# EasyEDA Pro project ProDoc_cyrus_V2.epro, board PCB2
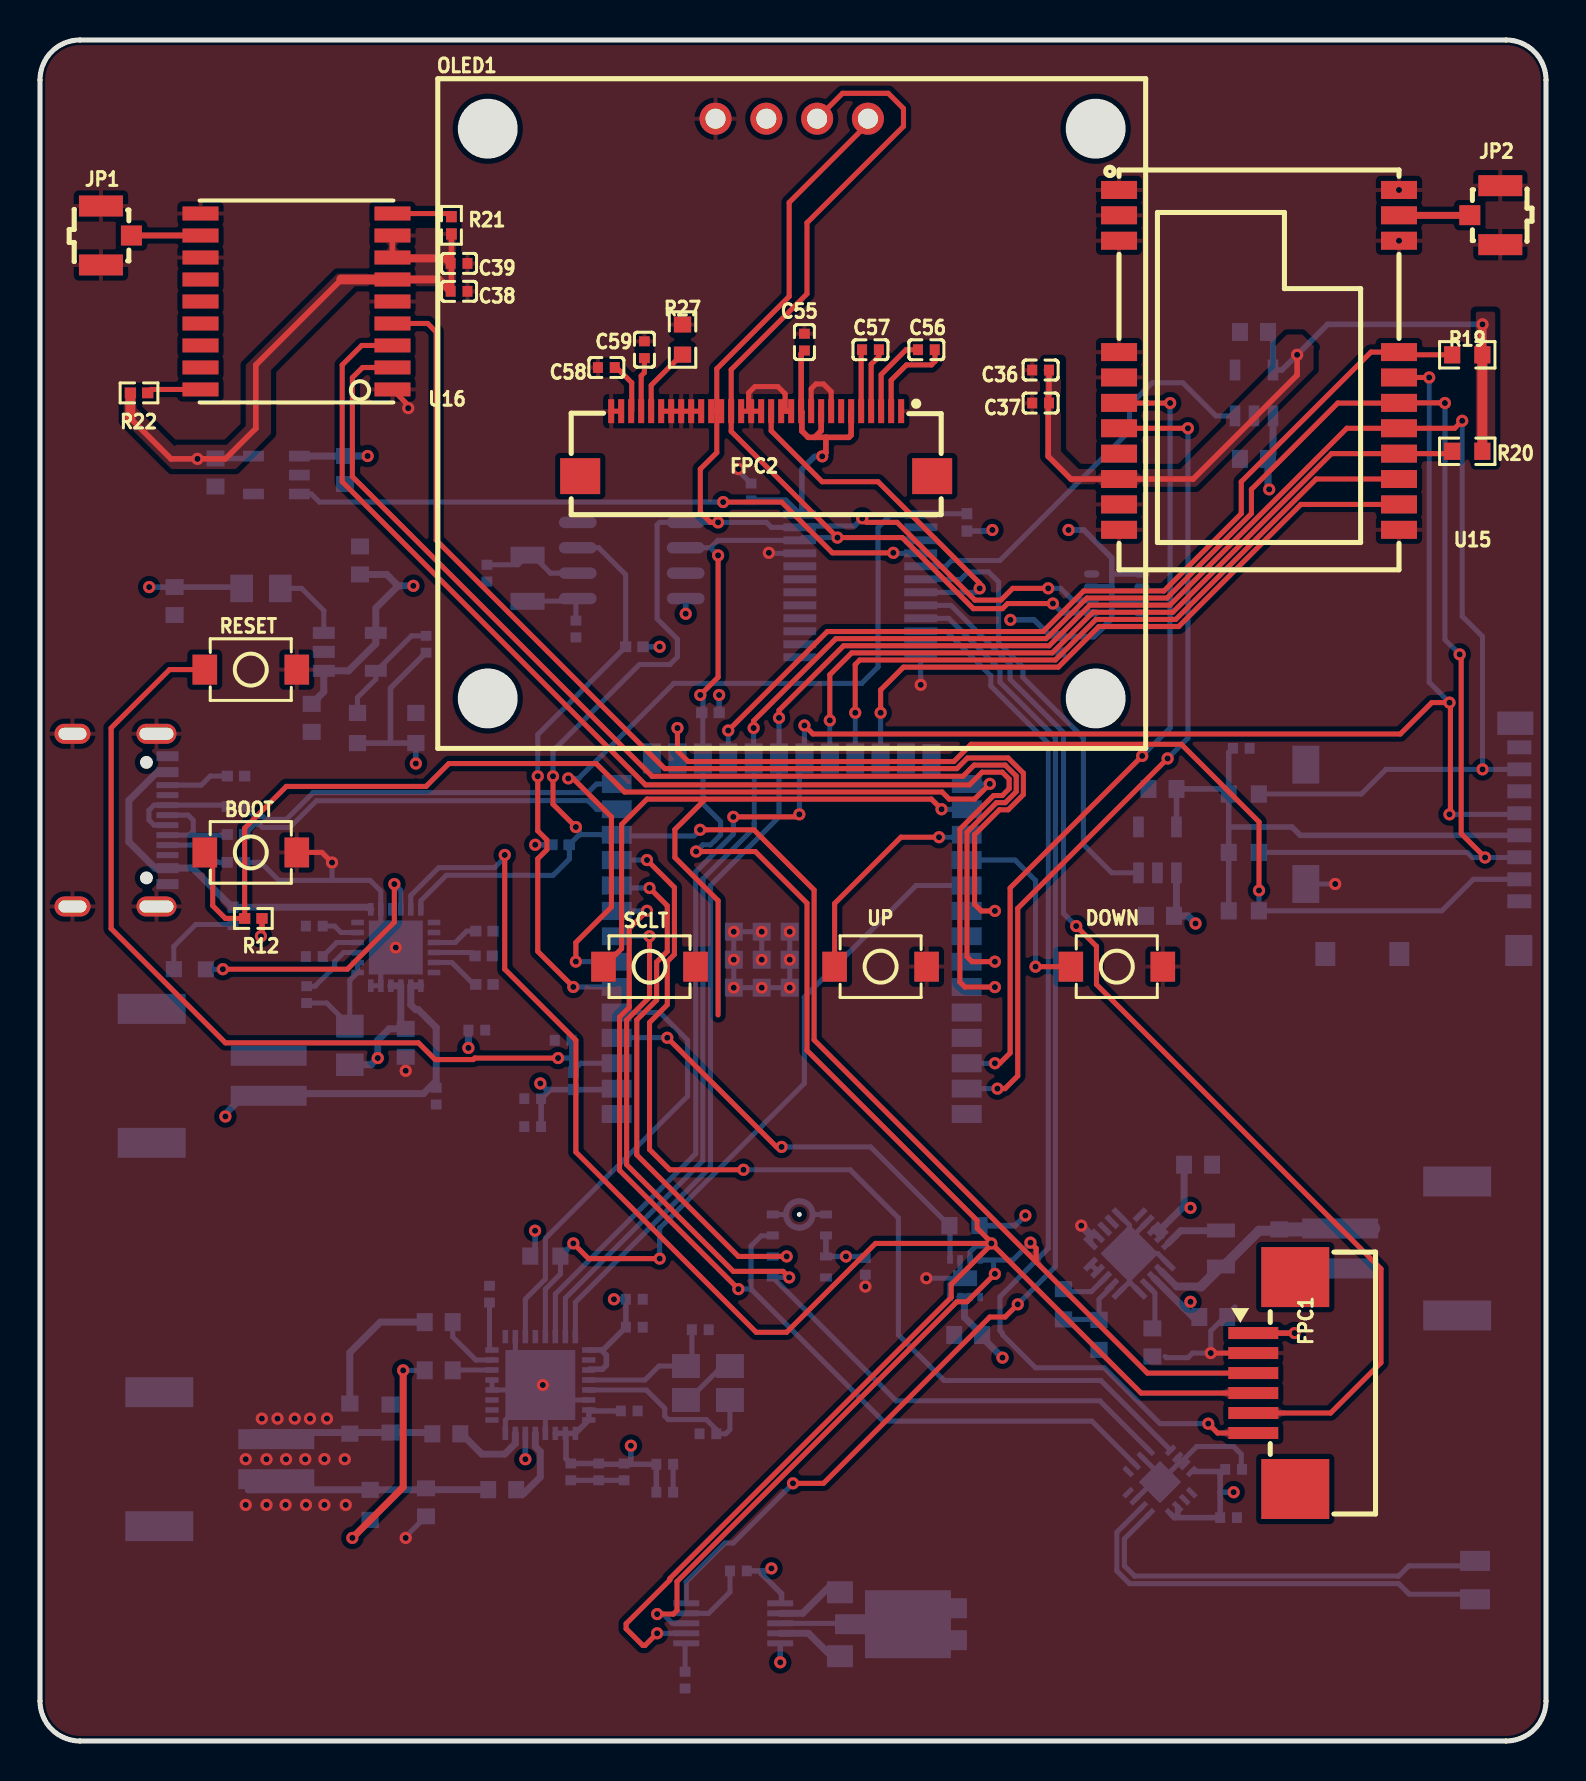
[diagram p5: board, top side]
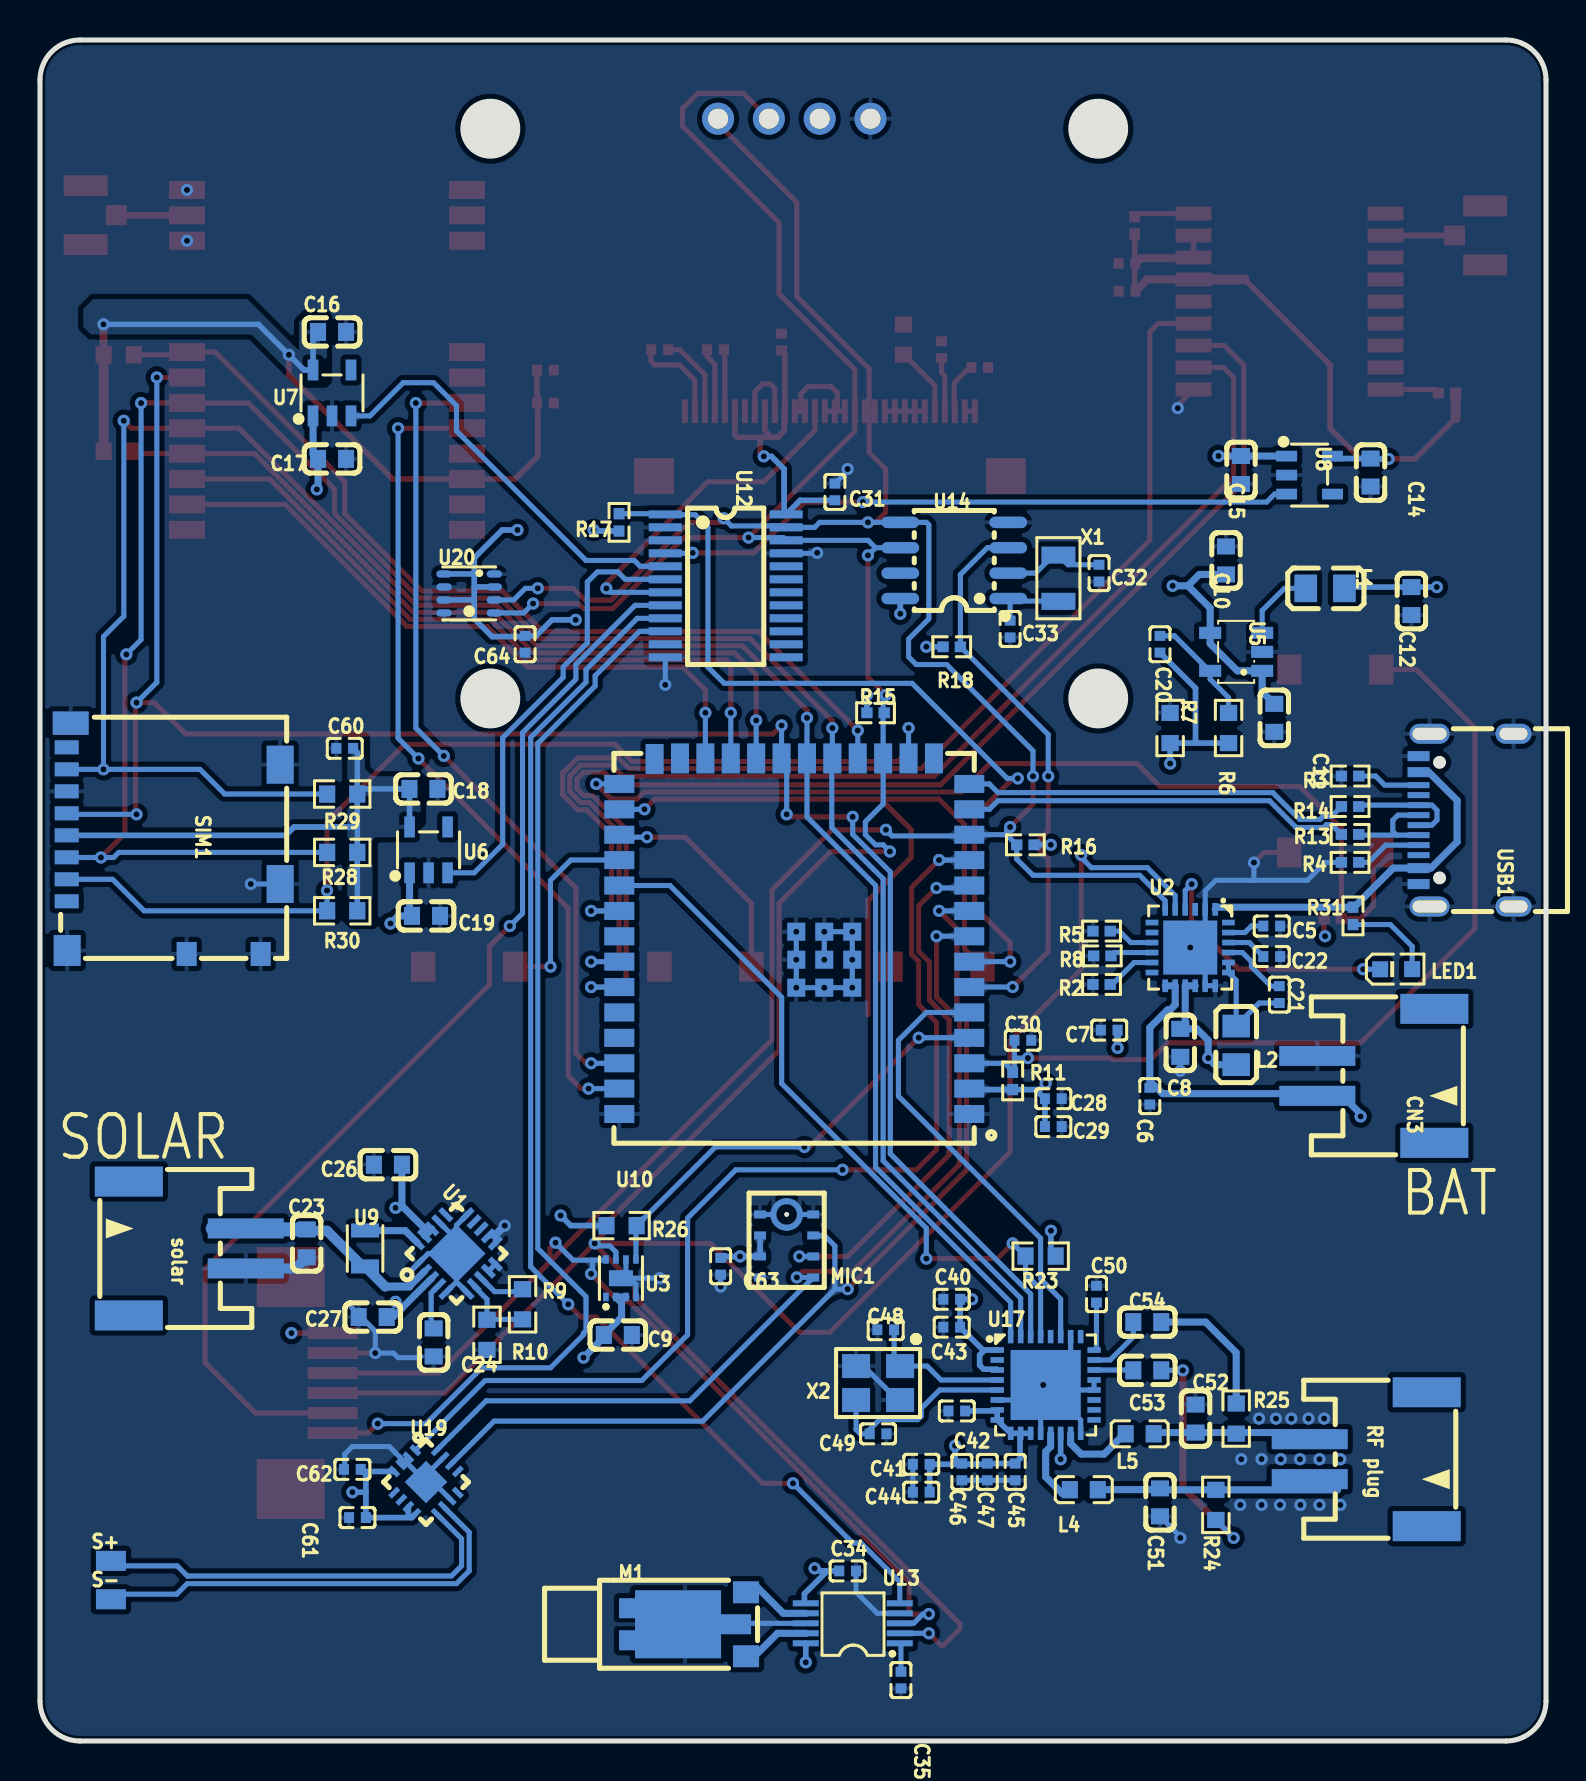
[diagram p6: board, bottom side, seen from below]

Outline 75.31 x 85.09 mm; copper layers: Top Layer, GND, VDD3V3, Inner3, Inner4, Inner5, Inner6, Inner7, Inner8, Inner9, Inner10, Inner11, Inner12, Inner13, Inner14, Inner15, Inner16, Inner17, Inner18, Inner19, Inner20, Inner21, Inner22, Inner23, Inner24, Inner25, Inner26, Inner27, Inner28, Inner29, Inner30, Bottom Layer. Coordinates in mm from the lower left corner of the outline.
Outline path: 0,83.09 0,2 arc(0.59,0.59) 2,0 73.31,0 arc(74.73,0.59) 75.31,2 75.31,83.09 arc(74.73,84.5) 73.31,85.09 2,85.09 arc(0.59,84.5) 0,83.09
Stack: Top Layer 0.035mm Outer layer thickness 1oz / Dielectric1 0.2104mm 7628 RC49% 8.6mil / GND 0.0152mm Inner layer thickness / Dielectric2 1.065mm 1.1mm H/HOZ Copper / VDD3V3 0.0152mm Inner layer thickness / Dielectric3 0.2104mm 7628 RC49% 8.6mil / Bottom Layer 0.035mm Outer layer thickness 1oz

## Design rules (mm)
net USB_DN: DP1
net USB_DP: DP1
template: Custom Config
spacing copperThickness1oz (default): track to track 0.102, other pairs 0.152 to 0.3
spacing copperThickness2oz: track to track 0.203, other pairs 0.152 to 0.3
track width copperThickness1oz (default): min 0.127, default 0.254, max 2.54
track width copperThickness2oz: min 0.203, default 0.254, max 2.54
track width vbus: min 0.127, default 0.35, max 2.54
track width VDD3V3: min 0.127, default 0.28, max 2.54
differential pair differentialPair (default): width min 0.127, default 0.254, max 2.54; gap min 0.152, default 0.152
via viaSize (default): diameter min 0.5, default 0.61, max 10; hole min 0.3, default 0.305, max 6.3
net VBAT uses vbus
net VSYS uses vbus
net VDD3V3 uses VDD3V3
net GPS_VDD uses VDD3V3
net LORA_VDD uses VDD3V3
net SD_VDD uses VDD3V3
net VBUS uses vbus

## Placement (name value [footprint] x y rotation side)
BOOT  TS-1088-AR02016  [SW-SMD_L3.9-W2.9-LS4.8]  10.54 44.45 0 top
C5  10uF  [C0402]  13.72 40.77 180 bottom
C6  10uF  [C0402]  19.81 32.26 270 bottom
C7  10uF  [C0402]  21.84 35.56 180 bottom
C8  22uF  [C0603]  18.29 34.93 270 bottom
C9  100nF  [C0603]  46.42 20.31 0 bottom
C10  10uF  [C0603]  16 59.06 270 bottom
C11  100nF  [C0603]  13.59 51.18 90 bottom
C12  22uF  [C0603]  6.73 57.02 90 bottom
C14  10uF  [C0603]  8.78 63.45 270 bottom
C15  100nF  [C0603]  15.25 63.58 270 bottom
C16  10uF  [C0603]  60.71 70.49 180 bottom
C17  100nF  [C0603]  60.71 64.14 180 bottom
C18  10uF  [C0603]  56.13 47.63 180 bottom
C19  100nF  [C0603]  56.01 41.28 180 bottom
C20  22pF  [C0402]  19.3 54.86 90 bottom
C21  47nF  [C0402]  13.34 37.34 90 bottom
C22  10uF  [C0402]  13.72 39.24 180 bottom
C23  4.7uF  [C0603]  61.98 24.89 90 bottom
C24  10nF  [C0603]  55.63 19.94 90 bottom
C26  4.7uF  [C0603]  57.91 28.83 0 bottom
C27  100nF  [C0603]  58.67 21.21 0 bottom
C28  100nF  [C0402]  24.64 32.13 180 bottom
C29  10uF  [C0402]  24.64 30.73 180 bottom
C30  1uF  [C0402]  26.16 35.05 0 bottom
C31  100nF  [C0402]  35.56 62.48 90 bottom
C32  12pF  [C0402]  22.35 58.42 90 bottom
C33  12pF  [C0402]  26.8 55.63 90 bottom
C34  100nF  [C0402]  34.92 8.51 180 bottom
C35  1uF  [C0402]  32.26 3.05 90 bottom
C36  10uF  [C0402]  50.04 68.58 180 top
C37  100nF  [C0402]  50.04 66.93 180 top
C38  10uF  [C0402]  20.95 72.52 180 top
C39  100nF  [C0402]  20.95 73.91 0 top
C40  100nF  [C0402]  29.72 22.1 180 bottom
C41  100nF  [C0402]  31.24 13.84 180 bottom
C42  100nF  [C0402]  29.46 16.51 180 bottom
C43  100nF  [C0402]  29.72 20.7 180 bottom
C44  100nF  [C0402]  31.24 12.45 180 bottom
C45  100nF  [C0402]  26.54 13.46 90 bottom
C46  100nF  [C0402]  29.21 13.46 90 bottom
C47  100nF  [C0402]  27.94 13.46 90 bottom
C48  10pF  [C0402]  33.02 20.57 0 bottom
C49  10pF  [C0402]  33.4 15.37 0 bottom
C50  1uF  [C0402]  22.48 22.35 90 bottom
C51  100pF  [C0603]  19.3 11.94 270 bottom
C52  100pF  [C0603]  17.53 16.13 90 bottom
C53  1nF  [C0603]  19.94 18.54 0 bottom
C54  1nF  [C0603]  19.94 20.96 0 bottom
C55  100nF  [C0402]  38.23 69.98 270 top
C56  1uF  [C0402]  44.32 69.6 0 top
C57  1uF  [C0402]  41.53 69.6 0 top
C58  4.7uF  [C0402]  28.32 68.71 0 top
C59  4.7uF  [C0402]  30.23 69.6 270 top
C60  100nF  [C0402]  60.07 49.66 180 bottom
C61  10uF  [C0402]  59.44 11.18 180 bottom
C62  100nF  [C0402]  59.69 13.59 180 bottom
C63  100nF  [C0402]  41.27 23.75 270 bottom
C64  100nF  [C0402]  51.05 54.86 270 bottom
CN3  S2B-PH-SM4-TB(LF)(SN)  [CONN-SMD_P2.00_S2B-PH-SM4-TB-LF-SN]  8.51 33.27 90 bottom
DOWN  TS-1088-AR02016  [SW-SMD_L3.9-W2.9-LS4.8]  53.85 38.74 0 top
FPC1  FPC1.0-WSS11-6P211-H25  [FPC-SMD_FPC1.0-WSS11-6P211-H25]  61.72 17.91 90 top
FPC2  FPC-05FB-30PH20  [FPC-SMD_30P-P0.50_FPC-05FB-30PH20]  35.81 64.9 0 top
JP1  6GHz  [RF-SMD_FRF05002-JSS103M]  3.81 75.31 90 top
JP2  6GHz  [RF-SMD_FRF05002-JSS103M]  72.26 76.33 270 top
L1  2.2uH  [L0805]  11.05 57.66 0 bottom
L2  1uH  [L0805]  15.49 34.8 270 bottom
L4  470nH  [L0603]  23.11 12.57 180 bottom
L5  470nH  [L0603]  20.32 15.37 180 bottom
LED1  -  [LED0603-RD_GREEN]  7.49 38.61 180 bottom
M1  Z3OC1T8219731  [VIBRATING-MOTOR-SMD_3P-C9900001680]  41.53 5.84 180 bottom
MIC1  INMP441  [MIC-SMD_INMP441]  37.97 24.77 0 bottom
OLED1  HS13L03W2C01  [OLED-TH_L35.4-W33.5_HS13L03W2C01]  37.59 81.15 0 top
R2  NTCG104BH103HT1  [R0402]  22.23 37.85 0 bottom
R3  5.1kΩ  [R0402]  9.8 48.27 0 bottom
R4  5.1kΩ  [R0402]  9.8 43.95 0 bottom
R5  10kΩ  [R0402]  22.23 40.51 180 bottom
R6  100kΩ  [R0603]  15.88 50.67 270 bottom
R7  22.1kΩ  [R0603]  18.8 50.67 90 bottom
R8  200Ω  [R0402]  22.19 39.28 0 bottom
R9  10MΩ  [R0603]  51.18 21.84 90 bottom
R10  7.5MΩ  [R0603]  52.96 20.32 90 bottom
R11  10kΩ  [R0402]  26.67 33.02 270 bottom
R12  10kΩ  [R0402]  10.67 41.15 180 top
R13  22Ω  [R0402]  9.8 45.35 0 bottom
R14  22Ω  [R0402]  9.8 46.75 0 bottom
R15  4.7kΩ  [R0402]  33.53 51.44 0 bottom
R16  4.7kΩ  [R0402]  26.04 44.83 180 bottom
R17  10kΩ  [R0402]  46.36 60.96 90 bottom
R18  10kΩ  [R0402]  29.72 54.74 180 bottom
R19  10kΩ  [R0603]  71.37 69.34 180 top
R20  10kΩ  [R0603]  71.37 64.52 0 top
R21  10kΩ  [R0402]  20.57 75.82 90 top
R22  10kΩ  [R0402]  4.95 67.44 180 top
R23  10kΩ  [R0603]  25.27 24.26 180 bottom
R24  10kΩ  [R0603]  16.51 11.81 270 bottom
R25  10kΩ  [R0603]  15.49 16.13 90 bottom
R26  10kΩ  [R0603]  46.23 25.78 180 bottom
R27  560kΩ  [R0603]  32.13 70.1 270 top
R28  10kΩ  [R0603]  60.2 44.45 180 bottom
R29  10kΩ  [R0603]  60.2 47.37 180 bottom
R30  10kΩ  [R0603]  60.2 41.53 180 bottom
R31  1kΩ  [R0402]  9.65 41.28 270 bottom
RESET  TS-1088-AR02016  [SW-SMD_L3.9-W2.9-LS4.8]  10.54 53.59 180 top
RF plug  S2B-PH-SM4-TB(LF)(SN)  [CONN-SMD_P2.00_S2B-PH-SM4-TB-LF-SN]  8.89 14.1 90 bottom
S+  -  [Test-Point-0.5mm]  71.76 9.01 0 bottom
S-  -  [Test-Point-0.5mm]  71.76 7.09 0 bottom
SCLT  TS-1088-AR02016  [SW-SMD_L3.9-W2.9-LS4.8]  30.48 38.74 0 top
SIM1  1040310811  [SIM-SMD_8P-1040310811]  68.64 45.14 270 bottom
solar  S2B-PH-SM4-TB(LF)(SN)  [CONN-SMD_P2.00_S2B-PH-SM4-TB-LF-SN]  67.95 24.64 270 bottom
U1  BQ25570RGRR  [VQFN-20_L3.5-W3.5-P0.50-BL-EP2.0]  54.48 24.38 225 bottom
U2  BQ25896RTWR  [QFN-24_L4.0-W4.0-P0.50-TL-EP2.7]  17.79 39.69 270 bottom
U3  MAX17048G+T10  [TDFN-8_L2.0-W2.0-P0.50-BL-EP1.2]  46.26 23.15 180 bottom
U5  SY8089AAAC  [SOT-23-5_L3.0-W1.7-P0.95-LS2.8-BR]  15.49 54.48 180 bottom
U6  RT9080-33GJ5  [TSOT-23-5_L2.9-W1.6-P0.95-LS2.8-BL]  55.88 44.58 180 bottom
U7  RT9080-33GJ5  [TSOT-23-5_L2.9-W1.6-P0.95-LS2.8-BL]  60.71 67.43 180 bottom
U8  RT9080-33GJ5  [TSOT-23-5_L2.9-W1.6-P0.95-LS2.8-BL]  11.82 63.33 270 bottom
U9  22uH  [IND-SMD_L1.8-W1.3]  59.05 24.64 90 bottom
U10  2.4GHz  [WIRELM-SMD_ESP32-S3-WROOM-1U]  37.59 40.26 0 bottom
U12  XL9555  [TSSOP-24_L7.8-W4.4-P0.65-LS6.4-BL]  41.02 57.79 270 bottom
U13  -  [DRV2605LDGSR]  34.8 5.72 90 bottom
U14  PCF85063AT/A  [SO-8_L4.9-W3.9-P1.27-LS5.9-BL]  29.59 59.06 90 bottom
U15  E22-900M22S  [WIRELM-SMD_E22-900M22S]  60.96 69.09 180 top
U16  MAX-M10S-00B  [SMD-18_L10.1-W9.7-P1.10-TL_SKG09F]  12.83 72.01 180 top
U17  ST25R3916-AQWT  [VFQFPN-32_L5.0-W5.0-P0.50-TL-EP3.5]  25.02 17.81 180 bottom
U19  MAX98357AETE+T  [TQFN-16_L3.0-W3.0-P0.50-BL-EP1.5]  56.01 12.95 315 bottom
U20  BME280  [LGA-8_BME280_BL]  53.85 57.4 180 bottom
UP  TS-1088-AR02016  [SW-SMD_L3.9-W2.9-LS4.8]  42.04 38.74 0 top
USB1  HX TYPE-C-3.1-16PIN  [TYPE-C-SMD_HX-TYPE-C-16PIN]  4 46.07 90 bottom
X1  32.768kHz  [OSC-SMD_L3.2-W1.5]  24.38 58.17 270 bottom
X2  27.12MHz  [CRYSTAL-SMD_4P-L3.2-W2.5-BL_SIT8008BI]  33.4 17.91 0 bottom

## Footprints (pads in the part's own frame, mm; a bottom-side part is the same pattern mirrored in y, then rotated)
C0402
  rect 0.5x0.54 smd: 1(-0.42,0) 2(0.42,0)
C0603
  rect 0.8x0.9 smd: 1(-0.7,0) 2(0.7,0)
CONN-SMD_P2.00_S2B-PH-SM4-TB-LF-SN
  rect 1x3.8 smd: 1(-1,2.925) 2(1,2.925)
  rect 1.5x3.4 smd: 3(3.35,-2.925) 4(-3.35,-2.925)
CRYSTAL-SMD_4P-L3.2-W2.5-BL_SIT8008BI
  rect 1.4x1.2 smd: 1(-1.1,-0.85) 2(1.1,-0.85) 3(1.1,0.85) 4(-1.1,0.85)
DRV2605LDGSR
  rect 0.3x1.3 smd: 1(-0.827,-2.481) 2(-0.327,-2.481) 3(0.173,-2.481) 4(0.673,-2.481) 5(1.173,-2.481) 6(1.173,2.219) 7(0.673,2.219) 8(0.173,2.219) 9(-0.327,2.219) 10(-0.827,2.219)
FPC-SMD_30P-P0.50_FPC-05FB-30PH20
  rect 0.3x1.2 smd: 1(7.25,1.625) 2(6.75,1.625) 3(6.25,1.625) 4(5.75,1.625) 5(5.25,1.625) 6(4.75,1.625) 7(4.25,1.625) 8(3.75,1.625) 9(3.25,1.625) 10(2.75,1.625) 11(2.25,1.625) 12(1.75,1.625) 13(1.25,1.625) 14(0.75,1.625) 15(0.25,1.625) 16(-0.25,1.625) 17(-0.75,1.625) 18(-1.25,1.625) 19(-1.75,1.625) 20(-2.25,1.625) 21(-2.75,1.625) 22(-3.25,1.625) 23(-3.75,1.625) 24(-4.25,1.625) 25(-4.75,1.625) 26(-5.25,1.625) 27(-5.75,1.625) 28(-6.25,1.625) 29(-6.75,1.625) 30(-7.25,1.625)
  rect 2x1.8 smd: 31(-8.8,-1.625) 32(8.8,-1.625)
FPC-SMD_FPC1.0-WSS11-6P211-H25
  rect 0.6x2.5 smd: 1(2.5,1.05) 2(1.5,1.05) 3(0.5,1.05) 4(-0.5,1.05) 5(-1.5,1.05) 6(-2.5,1.05)
  rect 3x3.4 smd: 7(-5.3,-1.05) 8(5.3,-1.05)
IND-SMD_L1.8-W1.3
  rect 0.7x1.4 smd: 1(-0.9,0) 2(0.9,0)
L0603
  rect 0.8x0.864 smd: 1(-0.7,0) 2(0.7,0)
L0805
  rect 1.133x1.377 smd: 1(-0.966,0) 2(0.966,0)
LED0603-RD_GREEN
  rect 0.8x0.8 smd: 1(-0.799,-0.004) 2(0.799,0.004)
LGA-8_BME280_BL
  oval 0.767x0.364 smd: 1(1.258,0.975) 2(1.258,0.325) 3(1.258,-0.325) 4(1.258,-0.975) 5(-1.258,-0.975) 6(-1.258,-0.325) 7(-1.258,0.325) 8(-1.258,0.975)
MIC-SMD_INMP441
  rect 0.6x0.4 smd: 1(-1.33,1.575) 2(-1.33,0.525) 3(-1.33,-0.525) 4(-1.33,-1.575) 6(1.33,-1.575) 7(1.33,-0.525) 8(1.33,0.525) 9(1.33,1.575)
  custom 0.966x1.626 smd: 5(-0.661,-1.575)
  custom 0.963x1.626 smd: 5(0.664,-1.575)
OLED-TH_L35.4-W33.5_HS13L03W2C01
  round 1.6 hole 1: 1(-3.81,0) 2(-1.27,0) 3(1.27,0) 4(3.81,0)
OSC-SMD_L3.2-W1.5
  rect 0.85x1.7 smd: 1(-1.155,0) 2(1.155,0)
QFN-24_L4.0-W4.0-P0.50-TL-EP2.7
  rect 0.633x0.28 smd: 1(-1.911,1.25) 2(-1.911,0.75) 3(-1.911,0.25) 4(-1.911,-0.25) 5(-1.911,-0.75) 6(-1.911,-1.25) 13(1.911,-1.25) 14(1.911,-0.75) 15(1.911,-0.25) 16(1.911,0.25) 17(1.911,0.75) 18(1.911,1.25)
  rect 0.28x0.633 smd: 7(-1.25,-1.911) 8(-0.75,-1.911) 9(-0.25,-1.911) 10(0.25,-1.911) 11(0.75,-1.911) 12(1.25,-1.911) 19(1.25,1.911) 20(0.75,1.911) 21(0.25,1.911) 22(-0.25,1.911) 23(-0.75,1.911) 24(-1.25,1.911)
  rect 2.7x2.7 smd: 25(0,0)
R0402
  rect 0.566x0.54 smd: 1(-0.433,0) 2(0.433,0)
R0603
  rect 0.806x0.864 smd: 1(-0.753,0) 2(0.753,0)
RF-SMD_FRF05002-JSS103M
  rect 1x1.05 smd: 1(0,-0.762)
  rect 1.05x2.2 smd: 2(-1.475,0.762) 3(1.475,0.762)
SIM-SMD_8P-1040310811
  rect 0.7x1.2 smd: 1(3.138,-5.338) 2(2.038,-5.338) 3(0.938,-5.338) 4(-0.163,-5.338) 5(-1.262,-5.338) 6(-2.362,-5.338) 7(-3.462,-5.338) 8(-4.562,-5.338)
  rect 1.17x1.8 smd: 9(-5.772,-5.138)
  rect 1.55x1.35 smd: 10(5.598,-5.312)
  rect 1.2x1 smd: 11(5.772,0.662) 12(5.772,4.362)
  rect 1.9x1.35 smd: 13(2.272,5.338) 14(-3.697,5.338)
SMD-18_L10.1-W9.7-P1.10-TL_SKG09F
  rect 1.8x0.7 smd: 1(-4.8,4.4) 2(-4.8,3.3) 3(-4.8,2.2) 4(-4.8,1.1) 5(-4.8,0) 6(-4.8,-1.1) 7(-4.8,-2.2) 8(-4.8,-3.3) 9(-4.8,-4.4) 10(4.8,-4.4) 11(4.8,-3.3) 12(4.8,-2.2) 13(4.8,-1.1) 14(4.8,0) 15(4.8,1.1) 16(4.8,2.2) 17(4.8,3.3) 18(4.8,4.4)
SO-8_L4.9-W3.9-P1.27-LS5.9-BL
  oval 0.574x1.888 smd: 1(-1.905,-2.699) 2(-0.635,-2.699) 3(0.635,-2.699) 4(1.905,-2.699) 5(1.905,2.699) 6(0.635,2.699) 7(-0.635,2.699) 8(-1.905,2.699)
SOT-23-5_L3.0-W1.7-P0.95-LS2.8-BR
  rect 1.1x0.6 smd: 1(1.3,-0.95) 2(1.3,0) 3(1.3,0.95) 4(-1.3,0.95) 5(-1.3,-0.95)
SW-SMD_L3.9-W2.9-LS4.8
  rect 1.23x1.5 smd: 1(-2.3,0) 2(2.3,0)
TDFN-8_L2.0-W2.0-P0.50-BL-EP1.2
  rect 0.28x0.425 smd: 1(-0.75,-0.938) 2(-0.25,-0.938) 3(0.25,-0.938) 4(0.75,-0.938) 5(0.75,0.938) 6(0.25,0.938) 7(-0.25,0.938) 8(-0.75,0.938)
  rect 1.2x0.8 smd: 9(0,0)
Test-Point-0.5mm
  rect 1.5x1 smd: 1(0,0)
TQFN-16_L3.0-W3.0-P0.50-BL-EP1.5
  rect 0.25x0.6 smd: 1(-0.749,-1.5) 2(-0.248,-1.5) 3(0.252,-1.5) 4(0.751,-1.5) 9(0.75,1.5) 10(0.25,1.5) 11(-0.25,1.5) 12(-0.749,1.5)
  rect 0.6x0.25 smd: 5(1.5,-0.748) 6(1.5,-0.248) 7(1.5,0.252) 8(1.5,0.752) 13(-1.5,0.752) 14(-1.5,0.252) 15(-1.5,-0.248) 16(-1.5,-0.748)
  rect 1.5x1.5 smd: 17(0,0)
TSOT-23-5_L2.9-W1.6-P0.95-LS2.8-BL
  rect 0.532x1.045 smd: 1(-0.95,-1.147) 2(0,-1.147) 3(0.95,-1.147) 4(0.95,1.147) 5(-0.95,1.147)
TSSOP-24_L7.8-W4.4-P0.65-LS6.4-BL
  rect 0.4x1.65 smd: 1(-3.575,-3.022) 2(-2.925,-3.022) 3(-2.275,-3.022) 4(-1.625,-3.022) 5(-0.975,-3.022) 6(-0.325,-3.022) 7(0.325,-3.022) 8(0.975,-3.022) 9(1.625,-3.022) 10(2.275,-3.022) 11(2.925,-3.022) 12(3.575,-3.022) 13(3.575,3.022) 14(2.925,3.022) 15(2.275,3.022) 16(1.625,3.022) 17(0.975,3.022) 18(0.325,3.022) 19(-0.325,3.022) 20(-0.975,3.022) 21(-1.625,3.022) 22(-2.275,3.022) 23(-2.925,3.022) 24(-3.575,3.022)
TYPE-C-SMD_HX-TYPE-C-16PIN
  oval 1x2 hole 0.6x1.7: 17(-4.32,1.825) 20(4.32,1.825)
  oval 1x1.8 hole 0.6x1.4: 18(-4.32,-2.376) 19(4.32,-2.376)
  rect 0.3x1.1 smd: A5(-1.25,2.374) A6(-0.25,2.374) A7(0.25,2.374) A8(1.25,2.376) B5(1.75,2.374) B6(0.75,2.374) B7(-0.75,2.374) B8(-1.75,2.376)
  rect 0.5x1.1 smd: A9B4(2.4,2.375) A12B1(3.2,2.375) B9A4(-2.4,2.375) B12A1(-3.2,2.375)
VFQFPN-32_L5.0-W5.0-P0.50-TL-EP3.5
  rect 0.665x0.28 smd: 1(-2.42,1.75) 2(-2.42,1.25) 3(-2.42,0.75) 4(-2.42,0.25) 5(-2.42,-0.25) 6(-2.42,-0.75) 7(-2.42,-1.25) 8(-2.42,-1.75) 17(2.42,-1.75) 18(2.42,-1.25) 19(2.42,-0.75) 20(2.42,-0.25) 21(2.42,0.249) 22(2.42,0.75) 23(2.42,1.25) 24(2.42,1.75)
  rect 0.28x0.665 smd: 9(-1.75,-2.42) 10(-1.25,-2.42) 11(-0.75,-2.42) 12(-0.249,-2.42) 13(0.251,-2.42) 14(0.75,-2.42) 15(1.25,-2.42) 16(1.75,-2.42) 25(1.75,2.42) 26(1.25,2.42) 27(0.75,2.42) 28(0.251,2.42) 29(-0.249,2.42) 30(-0.75,2.42) 31(-1.25,2.42) 32(-1.75,2.42)
  rect 3.5x3.5 smd: 33(0,0)
VIBRATING-MOTOR-SMD_3P-C9900001680
  rect 1.3x1.1 smd: 1(1.525,1.6) 2(1.525,-1.6)
  custom 6.6x3.4 smd: 3(-1.525,0)
VQFN-20_L3.5-W3.5-P0.50-BL-EP2.0
  rect 0.28x0.8 smd: 1(-1.001,-1.751) 2(-0.501,-1.751) 3(-0.001,-1.751) 4(0.499,-1.751) 5(1,-1.749) 11(0.999,1.749) 12(0.501,1.751) 13(-0.001,1.749) 14(-0.501,1.749) 15(-1.001,1.749)
  rect 0.8x0.28 smd: 6(1.75,-0.999) 7(1.75,-0.499) 8(1.75,0.001) 9(1.75,0.501) 10(1.75,1.001) 16(-1.75,0.999) 17(-1.75,0.499) 18(-1.75,-0.001) 19(-1.75,-0.501) 20(-1.75,-1.001)
  rect 2.05x2.05 smd: 21(-0.001,-0.001)
WIRELM-SMD_E22-900M22S
  rect 1.8x0.9 smd: 1(7,-8.5) 2(7,-7.23) 3(7,-5.96) 4(7,-0.39) 5(7,0.88) 6(7,2.15) 7(7,3.42) 8(7,4.69) 9(7,5.96) 10(7,7.23) 11(7,8.5) 12(-7,8.5) 13(-7,7.23) 14(-7,5.96) 15(-7,4.69) 16(-7,3.42) 17(-7,2.15) 18(-7,0.88) 19(-7,-0.39) 20(-7,-5.96) 21(-7,-7.23) 22(-7,-8.5)
WIRELM-SMD_ESP32-S3-WROOM-1U
  rect 1.5x0.9 smd: 1(-8.75,8.895) 2(-8.75,7.625) 3(-8.75,6.355) 4(-8.75,5.085) 5(-8.75,3.815) 6(-8.75,2.545) 7(-8.75,1.275) 8(-8.75,0.005) 9(-8.75,-1.265) 10(-8.75,-2.535) 11(-8.75,-3.805) 12(-8.75,-5.075) 13(-8.75,-6.345) 14(-8.75,-7.615) 27(8.75,-7.615) 28(8.75,-6.345) 29(8.75,-5.075) 30(8.75,-3.805) 31(8.75,-2.535) 32(8.75,-1.265) 33(8.75,0.005) 34(8.75,1.275) 35(8.75,2.545) 36(8.75,3.815) 37(8.75,5.085) 38(8.75,6.355) 39(8.75,7.625) 40(8.75,8.895)
  rect 0.9x1.5 smd: 15(-6.985,-8.895) 16(-5.715,-8.895) 17(-4.445,-8.895) 18(-3.175,-8.895) 19(-1.905,-8.895) 20(-0.635,-8.895) 21(0.635,-8.895) 22(1.905,-8.895) 23(3.175,-8.895) 24(4.445,-8.895) 25(5.715,-8.895) 26(6.985,-8.865)
  rect 0.9x0.9 smd: 41(-2.9,-0.225) 41(-2.9,1.175) 41(-2.9,2.575) 41(-1.5,-0.225) 41(-1.5,1.175) 41(-1.5,2.575) 41(-0.1,-0.225) 41(-0.1,1.175) 41(-0.1,2.575)

## Nets
As in the schematic, except:
GND: BOOT.2 C5.2 C6.2 C7.1 C8.2 C9.1 C10.1 C11.1 C12.1 C14.2 C15.2 C16.2 C17.2 C18.2 C19.2 C22.2 C23.1 C24.1 C26.2 C27.2 C28.2 C29.2 C30.1 C31.2 C32.1 C33.1 C34.2 C35.1 C36.2 C37.2 C38.1 C39.2 C40.1 C41.1 C42.1 C43.1 C44.1 C45.1 C46.1 C47.1 C48.2 C49.1 C50.2 C51.2 C52.2 C55.1 C58.1 C59.1 C60.1 C61.1 C62.1 C63.2 C64.2 CN3.2 DOWN.2 FPC1.2 FPC2.1 FPC2.8 FPC2.10 FPC2.12 FPC2.13 FPC2.15 FPC2.16 FPC2.17 FPC2.21 FPC2.22 FPC2.23 FPC2.24 FPC2.25 FPC2.29 FPC2.30 JP1.2 JP1.3 JP2.2 JP2.3 M1.3 MIC1.4 MIC1.5 MIC1.6 MIC1.9 OLED1.1 R2.2 R3.2 R4.2 R5.1 R7.2 R8.2 R10.1 R27.1 RESET.1 SCLT.2 SIM1.6 SIM1.9 SIM1.10 SIM1.11 SIM1.12 SIM1.13 SIM1.14 solar.2 U1.1 U1.5 U1.6 U1.9 U1.10 U1.11 U1.12 U1.15 U1.17 U1.21 U2.2 U2.17 U2.18 U2.25 U3.4 U3.6 U3.9 U5.2 U6.2 U7.2 U8.2 U10.1 U10.40 U10.41 U12.2 U12.3 U12.12 U12.21 U13.4 U13.8 U14.4 U15.1 U15.2 U15.3 U15.4 U15.5 U15.10 U15.11 U15.12 U15.20 U15.22 U16.1 U16.5 U16.10 U16.12 U17.6 U17.12 U17.16 U17.20 U17.21 U17.26 U17.33 U19.2 U19.3 U19.11 U19.15 U19.17 U20.1 U20.5 U20.7 UP.2 USB1.17 USB1.18 USB1.19 USB1.20 USB1.A12B1 USB1.B12A1 X2.2 X2.4
$1N5582: C23.2 solar.1 U1.2 U9.1
$4N2173: JP1.1 U16.11
$4N4448: C51.1 L4.2 R24.1 RF plug.1
$4N4453: C52.1 L5.2 R25.1 RF plug.2

Pads without a net: CN3 3 4; FPC1 7 8; FPC2 7 31 32; RF plug 3 4; SIM1 1 8; solar 3 4; U1 13 14 16; U2 3 7 8 12 24; U3 1; U6 4; U7 4; U8 4; U10 15 25 26 33 36 37; U12 11 13 14 15 16 17 18 19 20; U14 7; U15 8; U16 13 15 16 17; U17 2 17 18 19 25 28; U19 5 6 12 13; USB1 A8 B8

## Via types
v1: diameter 0.61, hole 0.305, Top Layer to Bottom Layer, 154 vias

## Routing (per net, layer and track width the routed paths; a pad name or vN(x,y) marks a point on that pad's centre or on a via; arc(x,y) is an arc through that point)
GND: length 132.8
  Top Layer w0.254: FPC2.16 35.44,66.65 35.44,67.44 35.75,67.75 36.9,67.75 37.26,67.38 37.26,66.62 37.36,66.52 ; FPC2.16 FPC2.17 ; FPC2.16 FPC2.15 ; v1(18.42,66.68) 18.42,66.82 U16.1 ; v1(14.61,43.94) 14.1,44.45 BOOT.2 ; 37.36,66.52 FPC2.13 ; 37.36,66.52 FPC2.12 ; FPC2.29 FPC2.30 ; FPC2.8 39.56,67.5 39.18,67.88 38.8,67.88 38.56,67.65 FPC2.10 ; FPC2.25 FPC2.24 FPC2.23 FPC2.22 FPC2.21 ; 60.67,19.41 v1(58.55,19.41)
  GND w0.254: v1(15.29,11.81) v1(14.22,11.81) v1(13.3,11.81) v1(12.28,11.81) v1(11.33,11.81) v1(10.29,11.81) v1(10.29,14.1) ; v1(10.29,14.1) 10.29,15.32 v1(11.09,16.13) v1(11.88,16.13) v1(12.74,16.13) v1(13.5,16.13) v1(14.35,16.13) ; v1(10.29,14.1) v1(11.33,14.1) v1(12.31,14.1) v1(13.27,14.1) v1(15.24,14.1)
  Bottom Layer w0.254: U19.17 56.01,13.3 U19.15 ; U19.17 57.04,13.98 57.1,13.98 ; U19.17 55.65,12.95 U19.11 ; U3.4 45.51,22.86 45.8,23.15 ; 14.59,43.05 11.94,43.05 11.04,43.95 R4.2 ; 14.59,43.05 14.61,43.07 v1(14.61,43.94) ; 14.59,43.05 16.51,43.05 17.04,42.52 U2.2 17.04,40.44 v1(17.79,39.69) 17.04,38.94 U2.17 U2.18 ; v1(36.09,39.08) v1(36.09,40.48) v1(34.69,40.48) v1(34.69,39.08) v1(34.69,37.68) v1(36.09,37.68) v1(37.49,37.68) v1(37.49,39.08) v1(37.49,40.48) ; 55.37,25.98 54.48,25.09 54.48,25.8 53.95,26.33 ; U17.26 23.77,19.06 U17.33 25.27,17.56 ; C51.2 18.29,10.22 v1(18.29,10.16) ; 56.89,14.19 57.1,13.98 ; 57.1,13.98 U19.3 ; 57.1,13.98 57.85,14.73 59.69,14.73 60.07,14.35 60.07,13.63 C62.1 ; C46.1 C47.1 C45.1 ; U12.12 v1(44.04,52.83) ; 54.48,22.97 54.48,22.97 U1.5 ; 54.48,22.97 U1.6 ; 54.48,22.97 U1.21 55.9,24.38 U1.1 ; U3.6 46.01,23.4 U3.9 45.8,23.15 ; C34.2 34.51,7.45 33.44,6.39 U13.4 ; v1(34.92,63.63) 34.92,63.54 C31.2 ; 45.8,23.15 v1(44.32,23.15) ; U17.6 25.77,17.06 25.27,17.56 ; U1.10 U1.9 ; 52.54,24.91 52.54,25.31 ; U17.16 23.27,16.06 24.77,17.56 U17.20 U17.21 ; 38.64,26.34 39.3,26.34 ; 25.27,17.56 U17.12 ; C63.2 v1(41.27,22.73) ; C41.1 C44.1 ; 56.26,19.24 56.32,19.18 57.4,19.18 57.63,19.41 v1(58.55,19.41) 58.55,20.51 59.76,21.72 ; v1(36.45,59.44) 36.48,59.41 U12.21 ; U13.8 42.75,5.89 43.05,5.59 ; C8.2 v1(18.29,33.53) ; X2.2 34.12,18.76 32.42,17.06 X2.4 ; 63.3,42.87 v1(64.77,42.87) ; U1.12 52.58,25.27 ; 37.31,26.34 36.64,26.34
  Bottom Layer w0.4: 52.54,25.31 v1(52.07,25.78)
  Bottom Layer w0.5: 66.67,23.64 62.53,23.64 C23.1
  vias: v1(14.22,14.1) v1(25.14,17.81) v1(67.96,77.59) v1(67.96,75.05)
VBAT: length 118
  VDD3V3 w0.35: v1(57.53,26.67) v1(57.53,21.97) 54.74,19.18 v1(48.13,19.18) 49.02,18.29 49.02,10.16 40.64,1.78 31.11,1.78 21.34,11.56 21.34,25.15 17.78,28.7 11.81,28.7 v1(9.27,31.24)
  Bottom Layer w0.35: v1(57.53,26.67) 57.31,26.67 57.21,26.77 ; 57.21,26.77 55.89,25.45 ; 57.21,26.77 C26.1 ; v1(57.53,21.97) 57.23,21.67 57.2,21.67 ; 55.89,25.45 U1.18 ; 55.89,25.45 U1.19 ; C27.1 57.66,21.21 57.2,21.67 ; U2.13 18.54,37.78 18.54,36.83 18.79,36.58 18.92,36.58 19.81,35.69 19.81,33.02 19.18,32.39 10.29,32.39 9.27,31.37 v1(9.27,31.24) ; U1.3 57.2,21.67 ; U3.3 U3.2 46.23,21.93 46.23,21.2 C9.2 47.12,20.19 v1(48.13,19.18)
VBUS: length 18.1
  Bottom Layer w0.35: USB1.A9B4 5.86,48.47 4.45,47.05 4.45,44.97 5.75,43.67 USB1.B9A4 7.64,43.67 9.6,41.71 R31.1 16.44,41.71 U2.1
VDD3V3: length 335.6
  Top Layer w0.28: FPC2.6 40.56,65.33 40.45,65.21 39.3,65.21 ; C55.2 38.06,69.39 FPC2.11 38.1,66.49 38.1,65.53 38.42,65.21 38.73,65.21 ; FPC2.9 39.06,65.54 38.73,65.21 ; 39.3,65.21 38.73,65.21 ; 39.3,65.21 39.3,64.45 v1(39.12,64.26) ; R12.1 11.1,40.31 v1(11.05,40.26) ; 60.67,20.41 v1(62.74,20.41)
  VDD3V3 w0.28: OLED1.2 39.12,78.36 v1(39.12,64.26) 46.23,64.26 47.63,62.87 v1(47.63,60.58) v1(51.44,60.58) ; 33.04,53.62 33.96,52.7 v1(33.96,52.32) ; 33.04,53.62 24.77,45.34 v1(24.77,44.83) 24.77,33.15 v1(25.02,32.89) 25.02,32 24.77,31.75 ; 33.04,53.62 31.45,55.2 ; 33.04,53.62 35.51,56.08 v1(48.53,56.08) ; 31.45,55.2 32.29,56.04 v1(32.29,56.39) ; 31.45,55.2 v1(30.99,54.74) ; v1(5.46,57.72) 10.35,57.72 13.97,54.1 13.97,50.17 15.24,48.9 15.72,48.9 ; 49.28,25.53 49.28,26.29 ; 49.28,25.53 41.53,25.53 40.26,24.26 39.5,24.26 37.08,21.84 29.97,21.84 29.72,22.1 ; 49.28,25.53 50.17,25.53 54.74,30.1 60.45,30.1 62.74,27.81 v1(62.74,20.41) 62.74,13.46 61.72,12.45 v1(59.69,12.45) ; 24.27,25.49 v1(24.27,14.1) 27.69,14.1 28.36,14.77 ; 24.27,25.49 24.3,25.53 v1(24.76,25.53) ; 24.27,25.49 24.27,31.26 24.77,31.75 ; 15.72,48.9 11.05,44.22 v1(11.05,40.26) 11.05,34.93 14.22,31.75 24.77,31.75 ; 15.72,48.9 v1(18.8,48.9) ; v1(37.02,3.94) 37.02,8.2 v1(36.58,8.64) 32,8.64 29.55,11.09 v1(29.55,14.77) 28.36,14.77 ; 29.72,22.1 v1(28.7,22.1) ; 29.72,22.1 29.59,21.97 29.59,20.7 28.5,19.61 28.5,14.91 28.36,14.77
  Bottom Layer w0.28: C31.1 37.29,62.06 U12.24 38.1,61.46 38.1,63.63 38.73,64.26 v1(39.12,64.26) ; 25.51,32.59 R11.2 28.8,32.59 U10.2 ; 25.51,32.59 25.33,32.59 v1(25.02,32.89) ; 25.51,32.59 C28.1 C29.1 ; 29.55,13.84 27.98,13.84 C47.2 C45.2 26.3,14.12 26.3,15.36 U17.10 ; 29.55,13.84 C41.2 C44.2 ; 29.55,13.84 v1(29.55,14.77) ; 17.55,49.92 17.53,49.94 17.53,52.67 C20.1 ; 17.55,49.92 R7.1 v1(18.8,48.9) ; 17.55,49.92 R6.2 ; U17.1 28.07,19.56 ; 28.07,19.56 28.32,19.3 28.32,18.8 28.12,18.6 27.48,18.6 U17.3 ; 28.07,19.56 28.16,19.56 C43.2 C40.2 v1(28.7,22.1) ; MIC1.7 MIC1.8 v1(40.3,24.24) 41.2,24.24 C63.1 ; 24.76,24.38 v1(24.76,25.53) ; v1(5.46,57.72) C12.2 10.02,57.72 L1.1 ; v1(33.96,52.32) R15.2 ; C34.1 36.07,8.51 ; 36.07,8.51 36.07,8.38 37.08,7.37 37.08,6.96 U13.6 ; 36.07,8.51 36.45,8.51 v1(36.58,8.64) ; U19.7 56.89,11.34 56.72,11.18 ; U20.8 53.61,58.38 53.59,58.37 ; R26.1 48.77,25.78 v1(49.28,26.29) ; 59.02,12.43 C61.2 56.72,11.18 ; 59.02,12.43 59.03,12.45 v1(59.69,12.45) ; 59.02,12.43 59.02,13.34 59.16,13.48 ; v1(47.63,60.58) 47.57,60.53 R17.1 ; U14.8 v1(32.29,56.39) ; 56.72,11.18 56.54,11.36 ; 53.59,57.06 53.62,57.08 U20.6 ; 53.59,57.06 53.59,57.73 ; 53.59,57.06 53.59,56.13 52.7,55.25 51.09,55.25 C64.1 50.51,55.28 49.71,56.08 v1(48.53,56.08) ; 59.16,13.48 59.27,13.59 ; 59.16,13.48 U19.4 ; C42.2 27.49,16.51 U17.7 U17.8 26.77,15.39 U17.10 ; R18.1 v1(30.99,54.74) ; 53.59,57.73 53.59,58.37 ; 53.59,57.73 U20.2 ; R16.2 v1(24.77,44.83) ; U17.11 U17.10 ; 53.59,58.37 53.59,59.18 52.2,60.58 v1(51.44,60.58) ; U13.10 v1(37.02,3.94) ; U17.14 v1(24.27,14.1)
ANT: length 3.5
  Top Layer w0.254: JP2.1 71.49,76.32
  Top Layer w0.349: 71.49,76.32 U15.21
BAT_ALRT: length 22
  Top Layer w0.254: v1(31.37,35.18) 36.83,29.72 v1(37.08,29.72)
  Bottom Layer w0.254: v1(31.37,35.18) 28.85,35.18 U10.4 ; v1(37.08,29.72) 41.54,29.72 R26.2 ; 45.47,25.53 45.51,25.49 U3.5
GPIO35: length 37.8
  Top Layer w0.254: SCLT.1 29.08,39.64 29.08,45.85 30.35,47.12 33.27,47.12 ; 33.27,47.12 31.75,45.59 31.75,44.2 33.91,42.04 33.91,36.32 ; 33.27,47.12 44.58,47.12 v1(45.08,46.61)
  Bottom Layer w0.254: U10.28 45.09,46.6 v1(45.08,46.61)
GPIO36: length 11.2
  Top Layer w0.254: UP.1 39.74,41.9 43.05,45.21 v1(44.96,45.21)
  Bottom Layer w0.254: v1(44.96,45.21) 46.22,45.21 U10.29
GPIO37: length 9.9
  Top Layer w0.254: 51.55,38.74 v1(49.78,38.74)
  Bottom Layer w0.254: 46.34,44.06 46.35,44.07 48.77,44.07 49.78,43.05 v1(49.78,38.74)
GPS_EN: length 32.3
  Top Layer w0.254: v1(34.16,61.98) 37.08,61.98 39.62,59.44 v1(42.67,59.44)
  Bottom Layer w0.254: U12.4 42.7,59.41 v1(42.67,59.44) ; U8.3 13.57,62.38 13.97,61.98 v1(34.16,61.98)
GPS_PPS: length 57.8
  Top Layer w0.254: v1(47.75,41.52) 47.07,41.52 46.74,41.85 46.74,45.34 47.98,46.58 48.42,46.58 49.17,47.34 49.17,48.42 48.42,49.18 46.38,49.18 45.85,48.64 31.24,48.64 19.81,60.07 19.81,70.49 19.39,70.91 U16.4
  Bottom Layer w0.254: U10.32 v1(47.75,41.52)
GPS_RX: length 63.5
  Top Layer w0.254: U16.3 16.09,69.81 15.11,68.83 15.11,62.99 30.28,47.83 46.48,47.83 47.11,48.46 48.12,48.46 48.46,48.12 48.46,47.64 48.12,47.3 47.69,47.3 46,45.61 46,37.97 46.25,37.71 v1(47.75,37.71)
  Bottom Layer w0.254: U10.35 v1(47.75,37.71)
GPS_TX: length 60.3
  Top Layer w0.254: U16.2 17.62,68.71 16.13,68.71 15.62,68.2 15.62,63.25 30.61,48.26 46.16,48.26 46.71,48.82 48.27,48.82 48.82,48.27 48.82,47.49 48.27,46.94 47.83,46.94 46.36,45.46 46.36,39.24 46.61,38.98 v1(47.75,38.98)
  Bottom Layer w0.254: U10.34 v1(47.75,38.98)
GPS_VDD: length 33.8
  Top Layer w0.28: U16.8 U16.7 ; 4.52,66.17 6.55,64.14 v1(7.87,64.14) 9.27,64.14 10.8,65.66 10.8,68.83 15.07,73.11 ; C38.2 20.57,72.56 20.57,75.39
  Top Layer w0.4: C39.1 20.28,74.17 17.67,74.17 U16.7 ; C38.2 19.94,73.11 U16.6
  Top Layer w0.5: 4.52,67.44 4.52,66.17 ; U16.6 15.07,73.11
  Bottom Layer w0.28: v1(7.87,64.14) 8.76,64.14 C14.1 10.55,64.15 U8.5
I2C_SCL: length 196
  Top Layer w0.254: 47.5,24.89 41.78,24.89 37.34,20.45 35.81,20.45 26.8,29.46 26.8,35.05 23.24,38.61 v1(23.24,44.32) ; 47.5,24.89 47.5,24.77 45.57,22.83 45.57,22.2 31.5,8.12 31.5,8.05 29.31,5.87 29.31,5.61 30.15,4.78 30.25,4.78 v1(30.86,5.39) ; 47.5,24.89 47.5,25.02 46.86,25.65 46.86,26.04 38.35,34.54 38.35,41.91 35.77,44.49 v1(32.81,44.49) ; v1(33.02,52.32) 33.91,53.21 v1(33.91,59.31) ; 60.67,17.41 55.06,17.41 v1(47.57,24.89) ; OLED1.3 40.13,82.42 42.42,82.42 43.18,81.66 43.18,80.77 38.35,75.95 38.35,72.39 34.56,68.6 FPC2.18 34.56,65.51 v1(39.88,60.2) 43.12,60.2 46.68,56.64 48.13,56.64 48.39,56.9 v1(50.65,56.9)
  Bottom Layer w0.254: U3.7 46.51,24.46 46.81,24.77 47.45,24.77 v1(47.57,24.89) ; v1(50.65,56.9) 51.12,56.43 U20.4 ; v1(23.24,44.32) 23.24,44.2 22.73,43.69 19.94,43.69 18.54,42.29 18.54,41.6 ; v1(39.88,60.2) 38.14,60.2 U12.22 33.9,60.06 33.53,59.69 ; U13.2 v1(30.86,5.39) ; 33.53,59.69 v1(33.91,59.31) ; 33.53,59.69 U14.6 ; 33.1,52.2 33.15,52.15 U10.17 33.15,46.87 34.04,45.98 34.04,45.34 33.53,44.83 33.15,44.83 v1(32.81,44.49)
I2C_SDA: length 159.7
  Top Layer w0.254: v1(33.91,60.96) 33.53,60.96 33.02,61.47 33.02,63.63 33.84,64.45 33.84,66.52 ; 33.84,66.52 FPC2.19 ; 33.84,66.52 33.84,68.64 37.47,72.26 37.47,76.96 41.4,80.9 OLED1.4 ; 33.84,66.52 FPC2.20 ; v1(25.65,48.26) 25.65,46.86 v1(26.8,45.72) ; v1(49.53,24.93) 49.82,24.64 49.82,23.97 ; v1(30.86,6.35) 31.67,6.35 31.85,6.53 31.85,7.98 45.85,21.98 46.36,21.98 v1(47.75,23.37) ; 49.82,23.97 55.37,18.41 60.67,18.41 ; 49.82,23.97 38.71,35.07 38.71,42.57 35.7,45.58 v1(33.01,45.58) ; v1(50.42,57.66) 48.64,57.66 48.06,57.07 46.75,57.07 42.86,60.96 41.32,60.96 v1(41.12,61.16)
  Bottom Layer w0.254: v1(47.75,23.37) 47.68,23.44 47.68,24.05 ; 26.98,45.34 28.84,45.34 U10.12 28.9,45.28 32.7,45.28 v1(33.01,45.58) ; 26.98,45.34 R16.1 26.47,44.12 25.65,43.31 20.32,43.31 19.05,42.04 19.05,41.61 U2.6 ; 26.98,45.34 26.98,45.54 v1(26.8,45.72) ; v1(25.65,48.26) 25.65,49.53 29.97,53.85 31.5,53.85 31.88,54.23 31.88,55.12 30.86,56.13 30.86,60.83 30.99,60.96 U14.5 v1(33.91,60.96) 36.32,60.96 36.57,60.71 U12.23 38.07,60.78 40.74,60.78 v1(41.12,61.16) ; v1(30.86,6.35) 31.16,6.35 31.62,5.89 U13.3 ; 47.68,24.05 47.04,24.05 U3.8 ; 47.68,24.05 48.65,24.05 v1(49.53,24.93) ; v1(50.42,57.66) 51.04,57.66 51.62,57.08 U20.3
I2S_BCLK: length 47.2
  Top Layer w0.254: v1(30.48,40.26) 30.48,37.21 29.34,36.07 29.34,28.83 34.67,23.5 37.16,23.5 v1(37.47,23.19)
  Bottom Layer w0.254: U10.8 28.85,40.26 v1(30.48,40.26) ; v1(37.47,23.19) MIC1.1 42.82,17.02 53,17.02 U19.16
I2S_DIN: length 26.3
  Top Layer w0.254: v1(30.48,42.67) 31.37,41.78 31.37,39.5 30.84,38.96 30.84,37.06 29.85,36.07 29.85,29.32 34.92,24.24 v1(37.34,24.24)
  Bottom Layer w0.254: U10.10 28.96,42.67 v1(30.48,42.67) ; MIC1.2 v1(37.34,24.24)
I2S_DOUT: length 52.8
  Top Layer w0.254: v1(35.18,28.58) 31.5,28.58 30.48,29.59 30.48,35.94 31.37,36.83 31.37,38.99 31.73,39.35 31.73,42.7 v1(30.35,44.07)
  Bottom Layer w0.254: v1(35.18,28.58) 40.51,28.58 42.93,26.16 42.93,20.32 45.21,18.03 53.05,18.03 U19.1 ; 28.84,44.06 28.85,44.07 v1(30.35,44.07)
I2S_LRCLK: length 50.4
  Top Layer w0.254: v1(34.92,22.61) 28.98,28.55 28.98,36.22 29.46,36.7 29.46,40.64 v1(30.35,41.53)
  Bottom Layer w0.254: U10.9 30.35,41.52 v1(30.35,41.53) ; 35.56,22.61 42.16,16 52.6,16 U19.14 ; 35.56,22.61 35.56,24.77 36.07,25.27 36.63,25.27 MIC1.3 ; 35.56,22.61 v1(34.92,22.61)
IO_EXP_INT: length 42.5
  Top Layer w0.254: v1(26.42,48.15) 26.65,48.15 28.58,46.23 28.58,41.72 26.8,39.94 v1(26.8,38.99)
  Bottom Layer w0.254: v1(26.8,38.99) 28.84,38.99 U10.7 ; v1(26.42,48.15) 26.94,48.15 31.7,52.91 41.1,52.91 41.91,53.72 41.91,60.71 42.55,61.34 44.02,61.34 U12.1 44.08,61.39 R17.2
KB_BL: length 54.2
  Top Layer w0.254: 60.67,15.41 58.89,15.41 v1(58.42,15.88)
  Bottom Layer w0.254: U12.10 45.33,55.51 47.55,53.29 47.55,52.77 50.42,49.9 50.42,24.64 48.01,22.23 48.01,20.53 48.13,20.4 48.13,20.33 49.78,18.67 53.21,18.67 56.01,15.88 v1(58.42,15.88)
KEY_INT: length 55.7
  Top Layer w0.254: 60.67,16.41 64.54,16.41 67.06,18.92 67.06,23.62 52.83,37.85 52.83,39.75 v1(51.82,40.77)
  Bottom Layer w0.254: U12.8 45.55,56.81 48.51,53.85 48.51,53.11 51.18,50.44 51.18,41.4 v1(51.82,40.77)
LCD_RST: length 17.8
  Top Layer w0.254: FPC2.14 36.56,65.54 39.12,62.99 41.91,62.99 46.99,57.91 v1(46.99,57.66)
  Bottom Layer w0.254: U12.7 46.79,57.46 v1(46.99,57.66)
LORA_BUSY: length 35.7
  Top Layer w0.254: U15.14 63.82,63.13 56.8,56.11 52.8,56.11 50.77,54.08 40.99,54.08 40.77,53.85 v1(40.77,51.44)
  Bottom Layer w0.254: v1(40.77,51.44) U10.23
LORA_CS: length 46.4
  Top Layer w0.254: R19.2 68.1,69.34 U15.19 66.56,69.48 60.07,62.99 60.07,61.4 56.21,57.53 52.2,57.53 50.17,55.5 39.37,55.5 v1(34.42,50.55)
  Bottom Layer w0.254: v1(34.42,50.55) U10.18
LORA_EN: length 21
  Bottom Layer w0.254: U12.5 45.3,58.76 45.59,59.06 48.01,59.06 54.48,65.53 54.48,66.8 55.63,67.95 57.15,67.95 58.81,66.29 59.76,66.29
LORA_IRQ: length 33.2
  Top Layer w0.254: v1(42.04,51.44) 42.04,52.58 43.18,53.72 50.92,53.72 52.95,55.75 56.94,55.75 63.05,61.86 U15.13
  Bottom Layer w0.254: v1(42.04,51.44) U10.24
LORA_RST: length 39.9
  Top Layer w0.254: R20.1 70.5,64.4 U15.15 64.58,64.4 56.65,56.46 52.65,56.46 50.62,54.43 40.59,54.43 39.5,53.34 v1(39.5,51.05)
  Bottom Layer w0.254: v1(39.5,51.05) U10.22
LORA_RXEN: length 40.8
  Top Layer w0.254: v1(47.75,33.9) 48,33.9 48.51,34.42 48.51,42.67 v1(55.12,49.28) ; U15.6 53.97,66.93 v1(56.52,66.93)
  Bottom Layer w0.254: U10.38 v1(47.75,33.9) ; v1(56.52,66.93) 56.52,50.67 v1(55.12,49.28)
LORA_TXEN: length 42.2
  Top Layer w0.254: v1(47.88,32.63) 48.26,32.63 48.89,33.27 48.89,41.66 v1(56.39,49.15) ; U15.7 v1(57.4,65.67)
  Bottom Layer w0.254: U10.39 v1(47.88,32.63) ; v1(57.4,65.67) 57.4,50.17 v1(56.39,49.15)
LORA_VDD: length 40.1
  Top Layer w0.28: 50.33,68.58 50.46,68.45 50.46,67.34 50.42,67.3 50.42,64.26 51.55,63.13 53.83,63.13 ; v1(62.86,69.34) 62.86,68.33 57.67,63.13 U15.9
  Top Layer w0.4: v1(72.14,70.87) 72.14,69.35 R19.1
  Top Layer w0.5: R19.1 R20.2
  Bottom Layer w0.28: C16.1 61.66,70.23 U7.5 62.1,68.58 v1(62.86,69.34) 64.39,70.87 v1(72.14,70.87)
MOTOR_EN: length 62.1
  Top Layer w0.254: v1(37.66,12.89) 39.18,12.89 47.5,21.21 48.26,21.21 v1(48.89,21.84)
  Bottom Layer w0.254: U12.9 45.44,56.16 48.01,53.59 48.01,52.97 50.77,50.2 50.77,23.72 v1(48.89,21.84) ; U13.5 32.32,7.97 34.26,9.91 34.67,9.91 v1(37.66,12.89)
NFC_CS: length 36.4
  Top Layer w0.254: v1(26.67,24.89) 27.43,24.13 v1(30.99,24.13)
  Bottom Layer w0.254: U10.31 43.81,42.79 38.22,37.21 38.22,32.89 30.99,25.66 v1(30.99,24.13) ; 25.27,20.23 25.27,22.61 26.03,23.36 R23.1 26.04,24.26 v1(26.67,24.89)
NFC_IRQ: length 22.3
  Bottom Layer w0.254: U17.27 24.27,22.11 25.27,23.11 25.27,25.15 32.39,32.26 32.39,35.05 30.99,36.44 U10.5
OUT+: length 3
  Bottom Layer w0.35: 39.47,7.72 38.14,6.39 U13.7
OUT-: length 3.6
  Bottom Layer w0.35: U13.9 38.43,5.39 39.83,3.99 40,3.99
OUTN: length 22.1
  Bottom Layer w0.254: U19.10 53.85,10.44 53.85,8.51 54.48,7.87 67.95,7.87 68.47,7.35 71.76,7.35
OUTP: length 21.1
  Bottom Layer w0.254: 67.92,8.25 54.74,8.25 54.23,8.76 54.23,10.12 U19.9 ; 71.76,8.63 71.63,8.76 68.45,8.76 67.92,8.23
RFI1: length 2
  Bottom Layer w0.254: C53.2 20.66,18.56 U17.22
RFI2: length 3.2
  Bottom Layer w0.254: C54.2 20.64,20.22 21.79,19.06 U17.23
RFO1: length 3.9
  Bottom Layer w0.349: 23.75,12.38 24.2,12.38 25.02,13.21 25.02,14.48 24.77,14.73 U17.13
RFO2: length 3.9
  Bottom Layer w0.349: L5.1 21.08,15.37 22.1,14.35 23.24,14.35 23.77,14.88 U17.15
RTC_INT: length 28.7
  Top Layer w0.254: v1(26.67,37.72) 24.89,39.5 24.89,44.13 25.35,44.59 25.35,45.07 24.89,45.53 v1(24.89,48.26)
  Bottom Layer w0.254: 26.89,59.69 27.94,59.69 29.29,58.35 R18.2 24.89,50.34 v1(24.89,48.26) ; U10.6 28.84,37.72 v1(26.67,37.72)
SD_CS: length 52.1
  Top Layer w0.254: v1(60.96,42.55) 60.96,45.97 57.07,49.86 46.56,49.86 45.7,49 32.41,49 31.88,49.53 v1(31.88,50.67)
  Bottom Layer w0.254: v1(60.96,42.55) 60.96,41.54 R30.1 70.1,41.53 71.68,43.11 SIM1.2 ; U10.16 v1(31.88,50.67)
SD_EN: length 22.5
  Bottom Layer w0.254: 54.93,43.43 53.6,43.43 52.17,44.86 52.17,50.19 49.15,53.21 49.15,53.72 47.94,54.93 47.94,57.98 47.43,58.48 46.42,58.48 46.05,58.11 U12.6
SD_VDD: length 27.5
  Bottom Layer w0.28: R30.2 R28.2 59.44,45.74 ; 59.44,45.74 59.44,47.63 ; 59.44,45.74 59.47,45.72 62.61,45.72 63.03,45.3 SIM1.4 ; 59.44,47.63 59.44,49.45 C60.2 ; 59.44,47.63 C18.1 ; U6.5 56.83,47.38 56.58,47.63
SPI_MISO: length 107.1
  Top Layer w0.254: v1(36.96,51.18) 36.96,51.56 40.18,54.79 50.46,54.79 52.5,56.82 56.5,56.82 65.35,65.67 U15.16 70.75,65.67 v1(71.12,66.04)
  Bottom Layer w0.254: SIM1.7 v1(72.14,48.6) ; v1(72.14,48.6) 67.31,48.6 66.08,47.37 R29.1 ; v1(72.14,48.6) 72.14,55.25 71.12,56.26 v1(71.12,66.04) ; v1(36.96,51.18) U10.20 36.96,46.23 33.53,42.8 33.53,28.7 26.77,21.95 U17.32
SPI_MOSI: length 113.3
  Top Layer w0.254: v1(35.69,50.67) 35.69,51.03 39.8,55.14 50.32,55.14 52.35,57.18 56.35,57.18 60.58,61.4 60.58,62.61 64.9,66.93 67.95,66.93 U15.17 70.25,66.94 v1(70.26,66.93) ; v1(70.99,54.36) 71.07,54.28 71.07,45.39 v1(72.26,44.2)
  Bottom Layer w0.254: v1(70.99,54.36) 70.26,55.09 v1(70.26,66.93) ; SIM1.3 73.97,44.2 v1(72.26,44.2) 71.63,44.2 71.37,44.45 R28.1 ; v1(35.69,50.67) U10.19 35.72,49.12 35.72,45.9 35.71,45.9 35.71,45.69 33.15,43.13 33.15,29.03 26.27,22.15 U17.31
SPI_SCK: length 98
  Top Layer w0.254: v1(37.97,46.36) 37.85,46.23 v1(34.67,46.23) ; U15.18 v1(69.47,68.21) ; v1(70.48,46.36) 70.53,46.4 70.53,51.9 v1(70.48,51.94) 69.6,51.94 68.03,50.37 38.65,50.37 v1(38.23,50.8)
  Bottom Layer w0.254: v1(37.97,46.36) 37.97,48.9 U10.21 v1(38.23,50.8) ; v1(70.48,46.36) 73.93,46.36 SIM1.5 ; U17.30 25.77,22.36 32.79,29.38 32.79,43.48 34.67,45.36 v1(34.67,46.23) ; v1(70.48,51.94) 69.47,52.96 v1(69.47,68.21)
USB_DN: length 19.6
  Bottom Layer w0.254: R13.2 10.73,45.84 10.98,45.84 11.13,45.69 12.49,45.69 13.83,47.04 27.41,47.04 27.84,46.6 U10.13
USB_DP: length 19.6
  Bottom Layer w0.254: R14.2 10.73,46.25 11.15,46.25 11.3,46.1 12.32,46.1 13.66,47.44 27.41,47.44 27.84,47.87 U10.14
VSYS: length 144.1
  VDD3V3 w0.35: v1(18.67,57.79) 19.18,58.29 57.4,58.29 57.79,57.91 ; v1(18.67,57.79) 20.57,57.79 24.26,54.1 24.26,47.88 18.92,42.55 18.92,38.86 16.89,36.83 16.89,35.48 ; v1(18.67,57.79) 16.38,60.07 v1(16.38,64.28) ; 16.89,35.48 v1(16.89,34.16) ; 16.89,35.48 21.08,35.48 21.42,35.14 v1(21.42,34.67) ; 57.79,57.91 55.75,55.88 54.1,55.88 52.7,54.48 51.94,54.48 50.3,52.84 50.3,45.97 55.37,40.89 v1(57.79,40.89) ; 57.79,57.91 61.47,61.6 v1(61.47,62.61)
  Bottom Layer w0.35: U8.1 15.25,64.28 C15.1 v1(16.38,64.28) ; C10.2 17.34,58.36 17.91,57.79 ; 17.91,57.79 16.79,56.67 U5.4 16.79,54.89 15.43,53.53 U5.1 14.19,52.49 C11.2 ; 17.91,57.79 v1(18.67,57.79) ; v1(61.47,62.61) 61.41,62.67 C17.1 61.66,64.39 U7.1 ; U6.1 56.83,41.4 C19.1 57.4,41.28 v1(57.79,40.89) ; U2.16 U2.15 18.04,35.87 C8.1 17.46,35.63 16.89,35.05 v1(16.89,34.16) 16.56,33.83 15.49,33.83 ; C7.2 v1(21.42,34.67)
XTI: length 9.9
  Bottom Layer w0.254: U17.5 30.32,17.56 31.24,16.64 31.24,16.26 31.42,16.08 33.33,16.08 33.82,15.58 C49.2 34.29,15.37 34.5,15.58 X2.3
XTO: length 7.1
  Bottom Layer w0.254: U17.4 30.25,18.06 30.95,18.76 X2.1 32.6,19.06 C48.1
$1N2347: length 5.2
  Bottom Layer w0.254: 7.47,45.32 9.33,45.32 R13.1 ; 7.47,45.32 USB1.B7 ; 7.47,45.32 7.66,45.51 7.66,46.06 7.41,46.32 USB1.A7
$1N2386: length 5.6
  Bottom Layer w0.254: R14.1 9.3,46.82 USB1.B6 5.7,46.82 5.45,46.56 5.45,46.07 5.7,45.82 USB1.A6
$1N2532: length 3.4
  Bottom Layer w0.254: R4.1 8.88,43.95 8.02,44.82 USB1.A5
$1N2542: length 3.2
  Bottom Layer w0.254: R3.1 8.52,48.27 8.06,47.82 USB1.B5
$1N3408: length 2.3
  Bottom Layer w0.254: U2.9 20.76,39.94 21.34,40.51 R5.2
$1N3887: length 3.8
  Bottom Layer w0.254: U5.3 14.19,56.55 13.08,57.66 L1.2
$1N4158: length 5.7
  Bottom Layer w0.254: C20.2 18.58,55.28 16.83,53.53 U5.5 16.79,53.12 15.88,52.2 R6.1
$1N4990: length 6
  Bottom Layer w0.254: 15.88,38.94 15.88,38.44 15.49,38.06 L2.1 14.34,36.92 C21.1
$1N5023: length 2.5
  Bottom Layer w0.254: U2.11 20.6,38.94 21.69,37.85 R2.1
$1N5118: length 1.9
  Bottom Layer w0.254: C5.1 14.73,40.77 15.06,40.44 15.88,40.44
$1N5123: length 3.4
  Bottom Layer w0.254: 15.88,39.44 15.18,39.44 14.73,38.99 14.73,38.74 13.76,37.76 C21.2
$1N5181: length 2
  Bottom Layer w0.254: 15.88,39.94 14.83,39.94 C22.1
$1N5325: length 2.1
  Bottom Layer w0.254: U2.10 21.59,39.44 R8.1
$1N5582: length 12.1
  Bottom Layer w0.35: 56.08,23.5 56.84,22.73
  Bottom Layer w0.4: 56.84,22.73 58.05,22.73
  Bottom Layer w0.5: C23.2 61.91,25.53 60.96,25.53 59.17,23.74 59.05,23.74 58.05,22.73
  Bottom Layer w0.7: 66.67,25.64 66.63,25.59 C23.2
$1N5688: length 2.4
  Bottom Layer w0.254: C24.2 55.75,20.77 55.75,22.41 U1.4
$1N5708: length 2.9
  Bottom Layer w0.35: U9.2 59.04,25.53 57.04,25.53 56.43,24.91
$1N6039: length 3.7
  Bottom Layer w0.254: 53.6,22.79 53.6,22.74 52.96,22.1 52.96,21.18 52.87,21.09 R9.1
$1N6199: length 2.4
  Bottom Layer w0.254: U1.8 52.58,22.48 51.3,22.48 R9.2
$1N11385: length 13.7
  Top Layer w0.254: v1(17.72,42.87) 17.72,40.96 15.37,38.61 v1(9.14,38.61)
  Bottom Layer w0.254: LED1.1 9.14,38.6 v1(9.14,38.61) ; v1(17.72,42.87) 18.04,42.55 U2.4
$1N11463: length 4.5
  Bottom Layer w0.254: LED1.2 6.69,39.75 7.78,40.84 9.65,40.84
$2N1117: length 45.8
  Top Layer w0.254: RESET.2 6.48,53.59 3.56,50.67 3.56,40.64 9.27,34.93 18.92,34.93 19.76,34.09 21.67,34.09 21.74,34.16 v1(25.91,34.16)
  Bottom Layer w0.254: C30.2 26.58,34.23 ; 26.58,34.23 26.58,33.54 R11.1 26.67,33.53 27.05,33.9 U10.3 ; 26.58,34.23 26.51,34.16 v1(25.91,34.16)
$2N1346: length 50
  Top Layer w0.254: BOOT.1 8.64,44.06 8.64,41.78 9.27,41.15 R12.2 10.23,45.67 12.32,47.75 19.3,47.75 20.45,48.9 27.81,48.9 29.23,47.47 45.11,47.47 45.47,47.12 46.74,47.12 v1(47.5,47.88)
  Bottom Layer w0.254: v1(47.5,47.88) 46.35,47.88 U10.27
$3N1457: length 3.6
  Bottom Layer w0.254: 24.38,57.02 26.77,57.02 26.8,57.06 ; C33.2 26.8,57.06 ; 26.8,57.06 26.89,57.15
$3N1692: length 5.1
  Bottom Layer w0.254: 22.35,58.84 23.9,58.84 X1.1 24.63,59.32 25.53,58.42 26.89,58.42
$3N2493: length 1.4
  Bottom Layer w0.254: U13.1 32.26,4.83 C35.2
$4N2100: length 3
  Top Layer w0.254: R21.2 20.42,76.41 U16.9
$4N2157: length 2.7
  Top Layer w0.254: R22.1 5.56,67.61 U16.18
$4N2173: length 3.5
  Top Layer w0.3: JP1.1 8.03,75.31 U16.11
$4N3909: length 2.4
  Bottom Layer w0.254: U17.24 22.48,19.68 C50.1
$4N4448: length 13.9
  Bottom Layer w0.349: RF plug.1 10.42,13.1 10.42,12.56 R24.1 19.3,12.56 ; 22.41,12.57 19.37,12.57 C51.1
$4N4453: length 10.4
  Bottom Layer w0.349: RF plug.2 10.94,15.1 10.61,15.43 C52.1 19.62,15.43
$4N4601: length 11.8
  Top Layer w0.349: v1(15.62,10.16) 18.16,12.7 v1(18.16,18.54)
  Bottom Layer w0.254: v1(18.16,18.54) C53.1 ; R24.2 15.62,10.17 v1(15.62,10.16)
$4N4826: length 6.9
  Bottom Layer w0.349: R25.2 15.49,19.43 17.02,20.96 C54.1
$5N1225: length 4.7
  Top Layer w0.254: C56.2 44.76,69.58 44.76,69.01 44.58,68.83 43.33,68.83 42.56,68.07 FPC2.2
$5N1231: length 4.2
  Top Layer w0.254: FPC2.3 42.06,68.35 43.31,69.6 C56.1
$5N1292: length 3.1
  Top Layer w0.254: C57.1 41.06,69.55 FPC2.5
$5N1298: length 3.2
  Top Layer w0.254: C57.2 41.95,69.25 41.56,68.87 FPC2.4
$5N1370: length 2.6
  Top Layer w0.254: C58.2 28.83,68.71 29.59,67.95 29.59,66.55 FPC2.28
$5N1440: length 2.7
  Top Layer w0.254: C59.2 30.23,68.45 30.06,68.29 FPC2.27
$5N1536: length 3.5
  Top Layer w0.254: R27.2 32.1,69.35 30.56,67.82 FPC2.26

## Copper pours and planes (outline as drawn; the poured copper is in the pictures)
GND on Top Layer: -1.78,85.85 76.2,85.85 76.2,-0.89 -1.78,-0.89
GND on Bottom Layer: -2.41,85.73 76.2,85.73 76.2,-2.54 -2.41,-2.54
GND on GND: -1.02,85.98 76.96,85.98 76.96,-1.4 -1.02,-1.4
GND on VDD3V3: -1.14,85.98 76.96,85.98 76.96,-0.89 -1.14,-0.89
VBAT on VDD3V3: 9.91,32.77 6.1,32.77 6.1,31.73 8.02,31.73 12.06,27.69 17.78,27.69 20.32,25.15 20.32,11.33 30.63,1.02 41.15,1.02 49.91,9.78 49.91,18.29 54.61,18.29 57.91,21.59 57.91,28.96 57.66,29.21 57.66,28.97 56.89,28.2 56.89,22.36 54.2,19.67 47.76,19.67 47.37,19.28 47.37,18.92 48.64,17.65 48.64,10.41 40.51,2.29 31.37,2.29 21.84,11.81 21.84,25.53 18.16,29.21 11.94,29.21 9.91,31.24
VDD3V3 on VDD3V3: 28.45,20.24 27.76,19.56 27.76,14.99 27.31,14.53 27.31,14.48 25.02,14.48 24.77,14.73 24.77,24.6 25.02,24.85 25.02,25.91 24.89,26.04 24.89,26.92 24.77,27.05 24.77,31.24 25.91,32.39 25.91,32.77 24.17,32.77 23.66,32.26 14.99,32.26 11.81,35.43 11.81,44.13 15.95,48.26 18.92,48.26 19.43,48.77 19.43,49.29 18.8,49.92 15.43,49.92 14.67,50.67 14.61,50.67 14.69,50.76 14.69,54.48 11.03,58.15 5.86,58.15 5.46,58.55 4.83,57.91 4.83,57.4 5.46,56.77 10.26,56.77 13.22,53.81 13.22,50.28 14.73,48.77 10.41,44.45 10.38,44.45 10.38,34.7 13.84,31.24 23.37,31.24 23.37,13.98 24.26,13.09 28.79,13.09 28.84,13.04 28.84,10.71 31.58,7.97 36.12,7.97 36.12,3.89 36.83,3.18 37.34,3.18 38.23,4.06 38.23,8.51 37.59,9.14 32.39,9.14 30.23,11.3 30.23,15.49 30.1,15.62 29,15.62 29,19.43 30.1,20.53 30.1,20.7 30.09,20.71 30.09,21.46 37.59,21.46 39.76,23.62 40.51,23.62 41.78,24.89 46.65,24.89 47.28,25.53 51.03,25.53 54.86,29.36 54.86,29.46 60.33,29.46 62.23,27.56 62.23,13.72 61.47,12.95 59.58,12.95 59.21,12.58 59.21,12.1 59.64,11.67 61.84,11.67 63.17,13 63.17,28.02 60.71,30.48 54.36,30.48 50.8,26.92 42.04,26.92 40.01,24.89 39.62,24.89 36.95,22.23 30.23,22.23 29.5,22.96 29.5,22.98 28.06,22.98 27.43,22.35 27.43,21.84 28.45,20.83
VDD3V3 on VDD3V3: 37.2,80.83 35.56,80.83 35.56,79.88 38.35,77.09 38.35,63.94 38.93,63.37 45.85,63.37 46.61,62.61 46.61,60.57 47.36,59.82 52.23,59.82 52.23,60.83 51.98,61.09 48.39,61.09 48.26,61.21 48.26,62.99 46.61,64.64 39.75,64.64 39.75,78.29
VDD3V3 on VDD3V3: 24.13,32.63 25.82,32.63 25.15,33.31 25.15,45.03 33.03,52.91 33.24,52.91 33.66,52.49 33.66,52.07 34.04,51.69 34.47,51.69 34.8,52.02 34.8,52.58 34.47,52.91 34.46,52.91 34.04,53.33 34.04,53.98 35.69,55.63 48.89,55.63 49.15,55.88 49.15,56.39 48.89,56.64 35.56,56.64 34.29,55.37 34.16,55.37 32.77,56.77 31.88,56.77 30.5,55.39 30.5,53.91 30.56,53.85 31.75,53.85 32,53.59 27.43,49.02 27.43,48.26 24.13,44.96
GPS_VDD on Top Layer: 16.76,75.68 20.8,75.68 20.8,72.77 16.76,72.77
GPS_VDD on Top Layer: 16.78,73.46 16.72,73.41 14.86,73.41 10.29,68.83 10.29,65.79 9.34,64.84 6.8,64.84 6.73,64.77 4.83,66.68 4.83,67.19 4.28,67.19 4.28,67.14 4.19,67.06 4.19,66.02 6.58,63.63 9.79,63.63 11.56,65.4 11.56,68.58 15.75,72.77 16.76,72.77 16.76,73.41 16.78,73.42
GPS_VDD on VDD3V3: 16.64,75.69 16,75.06 16,74.04 14.99,74.04 10.03,69.09 10.03,65.91 9.14,65.02 6.34,65.02 6.34,65.04 4.83,66.55 4.83,68.2 3.95,68.2 3.95,68.09 3.81,67.95 3.81,65.91 6.35,63.37 9.86,63.37 11.91,65.43 11.91,68.5 16.06,72.64 19.05,72.64 19.05,72.33 19.37,72.01 20.95,72.01 20.95,75.57 20.83,75.69
LORA_VDD on Top Layer: 71.8,71.5 72.77,71.5 72.77,63.86 71.8,63.86
LORA_VDD on Top Layer: 63.75,69.72 63.12,70.36 62.36,70.36 61.79,69.79 61.79,68.71 59.31,66.23 59.31,65.91 57.02,63.63 51.94,63.63 51.05,64.52 51.05,69.09 50.26,69.09 50.26,64.26 51.56,62.96 51.56,62.87 52.83,62.87 52.96,62.74 57.82,62.74 63.68,68.59 63.69,68.59 63.69,69.66
LORA_VDD on Bottom Layer: 72.77,70.36 73.15,70.74 73.15,71.63 72.64,72.14 64.94,72.14 62.4,69.6 62.36,69.6 62.36,70.99 61.98,71.37 61.09,71.37 60.96,71.25 60.96,68.07 61.09,67.95 62.32,67.95 64.73,70.36
LORA_VDD on VDD3V3: 63.88,68.59 63.88,70.23 61.98,70.23 61.66,69.91 61.66,68.06 57.22,63.63 51.82,63.63 50.92,64.52 50.92,68.93 50.63,69.22 50.17,69.22 50.04,69.09 50.04,63.88 51.31,62.61 57.79,62.61 63.77,68.59
SD_VDD on Bottom Layer: 59.66,40.87 59.94,41.15 59.94,50.21 59.1,50.21 59.05,50.17 59.05,48.64 58.67,48.26 56.39,48.26 56.26,48.13 56.26,45.97 57.02,45.21 58.55,45.21 58.67,45.09 58.67,40.87
VSYS on VDD3V3: 22.86,35.69 22.86,34.29 22.23,33.66 16.2,33.66 15.49,34.36 15.49,37.27 18.03,39.81 18.03,44.07 22.35,48.39 22.35,54.23 19.94,56.64 16.89,56.64 14.22,59.31 14.22,64.31 15.62,65.7 17.27,65.7 18.42,64.56 18.42,64.14 17.15,62.87 17.15,61.09 18.98,59.26 56.9,59.26 60.07,62.43 60.07,63.3 60.14,63.37 62.48,63.37 63.05,62.81 63.05,60.23 58.55,55.73 57.31,55.73 57.31,55.93 55.71,57.53 23.88,57.53 23.75,57.4 23.75,57.15 25.65,55.25 25.65,47.75 20.07,42.16 20.07,38.42 19.47,37.82 19.47,37.12 20.24,36.35 22.2,36.35
VSYS on VDD3V3: 55.88,57.79 54.74,56.64 53.64,56.64 52.13,55.13 52.13,54.93 51.12,54.93 49.53,53.34 49.53,45.85 55.37,40.01 58.42,40.01 58.8,40.39 58.8,41.22 58.49,41.53 55.63,41.53 50.78,46.38 50.77,46.38 50.77,52.55 52.3,54.08 53.57,54.08 54.74,55.25 56.99,55.25 57.79,56.04 57.79,56.13 56.13,57.79

Small or netless copper shapes (teardrops, artwork), in the pictures only: 23 on Top Layer, 49 on Bottom Layer, 2 on VDD3V3

## Text on the board
Bottom Silkscreen Layer: BAT | SOLAR
